# Altium schematic sheet Wheatstone bridge part III.SchDoc: Wheatstone bridge part III
size A4; Revision: 1; SheetNumber: 5; SheetTotal: 5; Units: mm
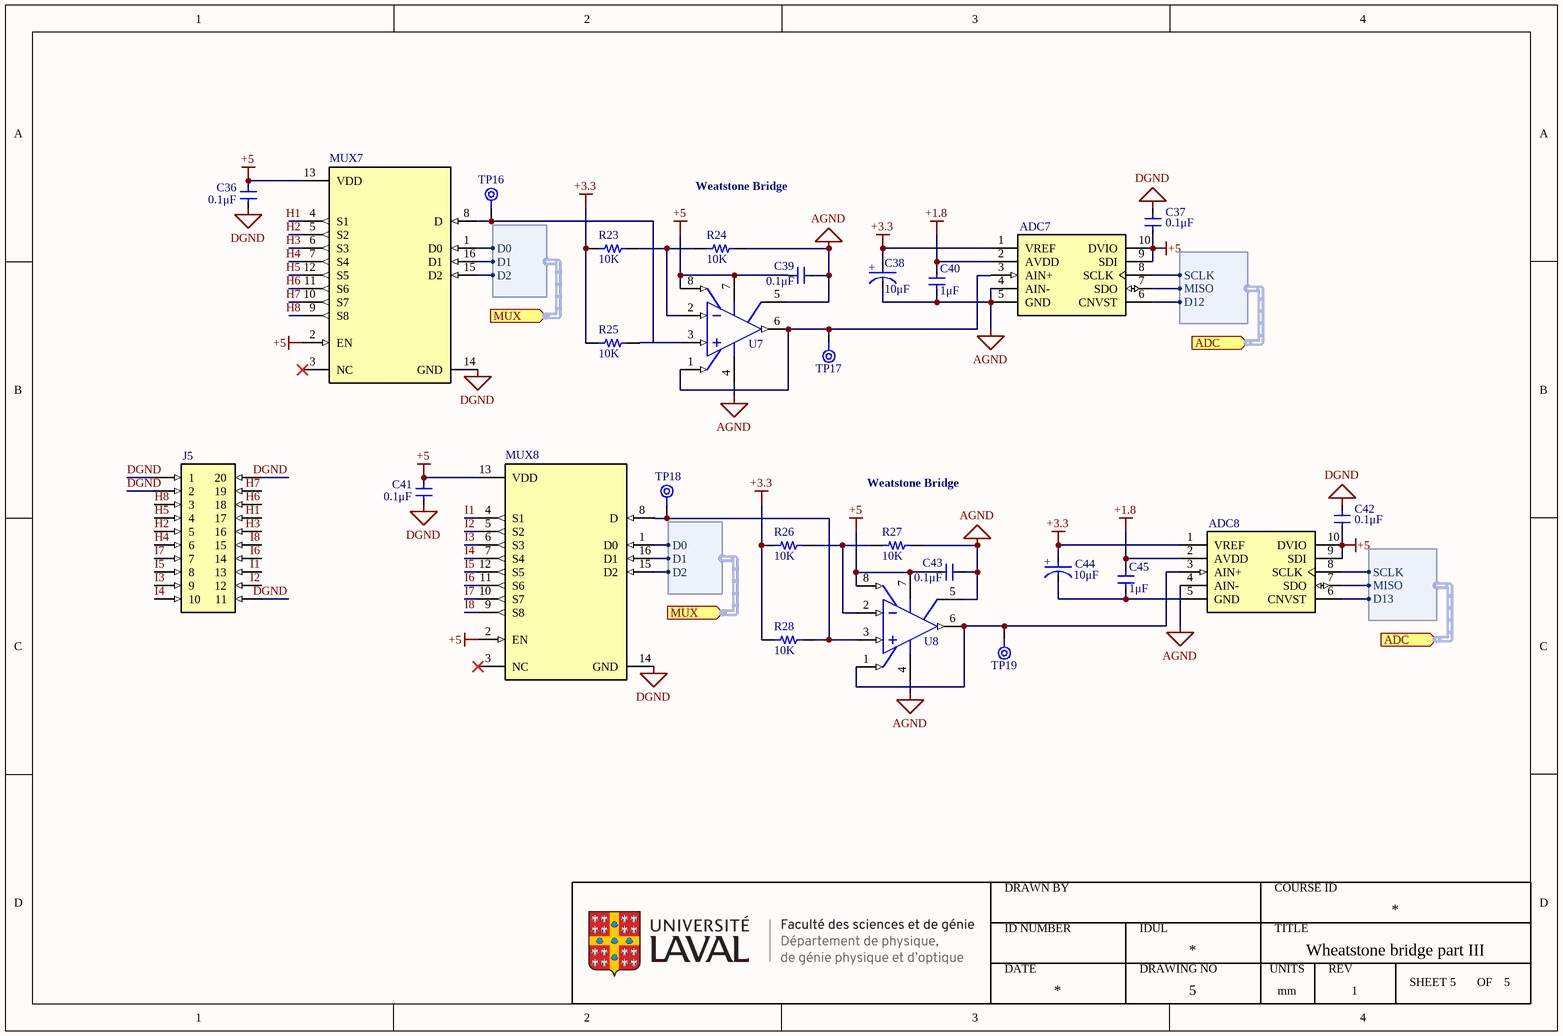
[diagram p0: Wheatstone bridge part III.SchDoc]

## Parts
ADC7  (no value)  [MCP33141-10-E/MS]
ADC8  (no value)  [MCP33141-10-E/MS]
C36  Capacitance: 0.1μF  [Cap Yaego 0603 MFG]  (hidden comment: Cap Ceramic 0.1 uF SMT 0603)
C37  Capacitance: 0.1μF  [Cap Ceramic 0.1 uF 50V SMT 0603]  (hidden comment: CC0603JRX7R9BB104)
C38  value 10μF  [Cap Tantalum 10 uF 16V SMT 1411]  (hidden comment: Cap 10 uF 16V Tantalum 1411)
C39  Capacitance: 0.1μF  [Cap Ceramic 0.1 uF 50V SMT 0603]  (hidden comment: Cap Ceramic 0.1 uF SMT 0603)
C40  value 1μF  [Cap Ceramic 1 uF 16V SMT 0603]  (hidden comment: Cap Ceramic 1 uF SMT 0603)
C41  Capacitance: 0.1μF  [Cap Yaego 0603 MFG]  (hidden comment: Cap Ceramic 0.1 uF SMT 0603)
C42  Capacitance: 0.1μF  [Cap Ceramic 0.1 uF 50V SMT 0603]  (hidden comment: CC0603JRX7R9BB104)
C43  Capacitance: 0.1μF  [Cap Ceramic 0.1 uF 50V SMT 0603]  (hidden comment: Cap Ceramic 0.1 uF SMT 0603)
C44  value 10μF  [Cap Tantalum 10 uF 16V SMT 1411]  (hidden comment: Cap 10 uF 16V Tantalum 1411)
C45  value 1μF  [Cap Ceramic 1 uF 16V SMT 0603]  (hidden comment: Cap Ceramic 1 uF SMT 0603)
J5  BF050-20-A-B-0400-0300-L-G  [Headers 20 Pos TH 0.079" 4-3 - B]  (value not drawn)
MUX7  TMUX1208PWR  [TMUX1208PWR]  (value not drawn)
MUX8  TMUX1208PWR  [TMUX1208PWR]  (value not drawn)
R23  value 10K  [Res 10K 0.1% SMT 0603]  (hidden comment: Res 10K SMT 0603)
R24  value 10K  [Res 10K 0.1% SMT 0603]  (hidden comment: Res 10K SMT 0603)
R25  value 10K  [Res 10K 0.1% SMT 0603]  (hidden comment: Res 10K SMT 0603)
R26  value 10K  [Res 10K 0.1% SMT 0603]  (hidden comment: Res 10K SMT 0603)
R27  value 10K  [Res 10K 0.1% SMT 0603]  (hidden comment: Res 10K SMT 0603)
R28  value 10K  [Res 10K 0.1% SMT 0603]  (hidden comment: Res 10K SMT 0603)
TP16  Test Point  [SQ Pad]  (value not drawn)  (no BOM)
TP17  Test Point  [SQ Pad]  (value not drawn)  (no BOM)
TP18  Test Point  [SQ Pad]  (value not drawn)  (no BOM)
TP19  Test Point  [SQ Pad]  (value not drawn)  (no BOM)
U7  Instrumentation Op Amp 35 MHz 8 pins  [MCP6N11-100E/SN]  (value not drawn)
U8  Instrumentation Op Amp 35 MHz 8 pins  [MCP6N11-100E/SN]  (value not drawn)

## Ports
ADC (in, harness 16), ADC (in, harness 18), MUX (in, harness 15), MUX (in, harness 17)

## Harnesses
15: D0, D1, D2
16: SCLK, MISO, D12
17: D0, D1, D2
18: SCLK, MISO, D13

## Nets
+1.8: ADC7.2(AVDD) ADC8.2(AVDD) C40.1 C45.1
+3.3: ADC7.1(VREF) ADC8.1(VREF) C38.2(A) C44.2(A) R23.1 R25.1 R26.1 R28.1
+5: ADC7.9(SDI) ADC7.10(DVIO) ADC8.9(SDI) ADC8.10(DVIO) C36.2 C37.1 C39.1 C41.2 C42.1 C43.1 MUX7.2(EN) MUX7.13(VDD) MUX8.2(EN) MUX8.13(VDD) U7.7(VDD) U7.8(EN/~{CAL}) U8.7(VDD) U8.8(EN/~{CAL})
AGND: ADC7.4(AIN-) ADC7.5(GND) ADC8.4(AIN-) ADC8.5(GND) C38.1(C) C39.2 C40.2 C43.2 C44.1(C) C45.2 R24.2 R27.2 U7.4(VSS) U7.5(VREF) U8.4(VSS) U8.5(VREF)
DGND: C36.1 C37.2 C41.1 C42.2 J5.1 J5.2 J5.11 J5.20 MUX7.14(GND) MUX8.14(GND)
H1: J5.17 MUX7.4(S1)
H2: J5.5 MUX7.5(S2)
H3: J5.16 MUX7.6(S3)
H4: J5.6 MUX7.7(S4)
H5: J5.4 MUX7.12(S5)
H6: J5.18 MUX7.11(S6)
H7: J5.19 MUX7.10(S7)
H8: J5.3 MUX7.9(S8)
I1: J5.13 MUX8.4(S1)
I2: J5.12 MUX8.5(S2)
I3: J5.9 MUX8.6(S3)
I4: J5.10 MUX8.7(S4)
I5: J5.8 MUX8.12(S5)
I6: J5.14 MUX8.11(S6)
I7: J5.7 MUX8.10(S7)
I8: J5.15 MUX8.9(S8)
NetADC7_3: ADC7.3(AIN+) TP17.1(TP) U7.1(VFG) U7.6(VOUT)
NetADC7_6: ADC7.6(CNVST) ; port ADC.D12
NetADC7_7: ADC7.7(SDO) ADC8.7(SDO) ; port ADC.MISO
NetADC7_8: ADC7.8(SCLK) ADC8.8(SCLK) ; port ADC.SCLK
NetADC8_3: ADC8.3(AIN+) TP19.1(TP) U8.1(VFG) U8.6(VOUT)
NetADC8_6: ADC8.6(CNVST) ; port ADC.D13
NetMUX7_1: MUX7.1(D0) MUX8.1(D0) ; port MUX.D0
NetMUX7_8: MUX7.8(D) R25.2 TP16.1(TP) U7.3(VIP)
NetMUX7_15: MUX7.15(D2) MUX8.15(D2) ; port MUX.D2
NetMUX7_16: MUX7.16(D1) MUX8.16(D1) ; port MUX.D1
NetMUX8_8: MUX8.8(D) R28.2 TP18.1(TP) U8.3(VIP)
NetR23_2: R23.2 R24.1 U7.2(VIM)
NetR26_2: R26.2 R27.1 U8.2(VIM)

Not connected (* = marked no-connect by the designer): MUX7 3(NC)*; MUX8 3(NC)*

## Notes on the sheet
- Weatstone Bridge
- DRAWN BY
- COURSE ID
- ID NUMBER
- DATE
- IDUL
- DRAWING NO
- TITLE
- UNITS
- REV
- SHEET
- OF
- (in symbol Cap 10 uF 16V Tantalum 1411) +

## Library data of the parts
ADC7 ADC8 = ADC 12 bits 1MSPS: 12 Bit Analog to Digital Converter 1 Input 1 SAR 10-MSOP; Supplier 1: Digi-Key; Supplier Part Number 1: MCP33141-10-E/MS-ND
C36 C39 C41 C43 = Cap Ceramic 0.1 uF SMT 0603: 0.1 µF ±5% 50V Ceramic Capacitor X7R 0603 (1608 Metric); Part Number: CC0603JRX7R9BB104; manufacturer: Yageo; Applications: General Purpose; componentlink1description: Datasheet; componentlink1url: https://www.yageo.com/upload/media/product/productsearch/datasheet/mlcc/UPY-GPHC_X7R_6.3V-to-50V_18.pdf; componentlink2description: DigiKey Link; componentlink2url: https://www.digikey.com/en/products/detail/yageo/CC0603JRX7R9BB104/5195188; Device Package: 0603 (1608 Metric); lastupdated: 2023-03-06 20:08:09; Lifecycle Status: Active; Minimum Order: 1; Mounting Type: Surface Mount, MLCC; Operating Temperature: -55°C ~ 125°C; Package / Case: 0603 (1608 Metric); packaging: TapeAndReel; partid: 12474; Part Status: Active; price: 0.01; series: CC; Size / Dimension: 0.063" L x 0.031" W (1.60mm x 0.80mm); Temperature Coefficient: X7R; Thickness (Max): 0.035" (0.90mm); Tolerance: ±5%; Voltage - Rated: 50V; Supplier 1: Digi-Key; Supplier Part Number 1: 311-1779-1-ND; Supplier 2: Digi-Key; Supplier Part Number 2: 311-1779-6-ND; Supplier 3: Digi-Key; Supplier Part Number 3: 311-1779-2-ND
C37 C42 = Cap Ceramic 0.1 uF SMT 0603: 0.1 µF ±5% 50V Ceramic Capacitor X7R 0603 (1608 Metric); manufacturer: Yageo; Part Number: CC0603JRX7R9BB104; Applications: General Purpose; componentlink1description: Datasheet; componentlink1url: https://www.yageo.com/upload/media/product/productsearch/datasheet/mlcc/UPY-GPHC_X7R_6.3V-to-50V_18.pdf; componentlink2description: DigiKey Link; componentlink2url: https://www.digikey.com/en/products/detail/yageo/CC0603JRX7R9BB104/5195188; Device Package: 0603 (1608 Metric); lastupdated: 2023-03-06 20:08:09; Lifecycle Status: Active; Minimum Order: 1; Mounting Type: Surface Mount, MLCC; Operating Temperature: -55°C ~ 125°C; Package / Case: 0603 (1608 Metric); packaging: TapeAndReel; partid: 12474; Part Status: Active; price: 0.01; series: CC; Size / Dimension: 0.063" L x 0.031" W (1.60mm x 0.80mm); Temperature Coefficient: X7R; Thickness (Max): 0.035" (0.90mm); Tolerance: ±5%; Voltage - Rated: 50V; Supplier 1: Digi-Key; Supplier Part Number 1: 311-1779-1-ND; Supplier 2: Digi-Key; Supplier Part Number 2: 311-1779-6-ND; Supplier 3: Digi-Key; Supplier Part Number 3: 311-1779-2-ND
C38 C44 = Cap 10 uF 16V Tantalum 1411: 10 µF Molded Tantalum Capacitors 16 V 1411 (3528 Metric) 2Ohm; Voltage Rating: 16V; Case Code (Imperial): 1411; Supplier 1: Digi-Key; Supplier Part Number 1: 718-1124-1-ND; Supplier 2: Digi-Key; Supplier Part Number 2: 718-1124-6-ND; Supplier 3: Digi-Key; Supplier Part Number 3: 718-1124-2-ND
C40 C45 = Cap Ceramic 1 uF SMT 0603: 1 µF ±10% 16V Ceramic Capacitor X7R 0603 (1608 Metric); Dielectric: XR7; Tolerance: 10%; Max Operating Temperature: 125°C; Case Code (Imperial): 0603; Voltage Rating (DC): 16V; Resistor Type: Ceramic; Height: 0.8mm; Length: 1.6mm; Construction: Flat; Termination: SMT/SMD; Min Operating Temperature: -55°C; Supplier 1: Digi-Key; Supplier Part Number 1: 13-CC0603KPX7R7BB105CT-ND; Supplier 2: Digi-Key; Supplier Part Number 2: 13-CC0603KPX7R7BB105DKR-ND; Supplier 3: Digi-Key; Supplier Part Number 3: 13-CC0603KPX7R7BB105TR-ND
J5 = Headers 20 Pos TH 0.079" 4-3: Connector Header Through Hole 20 position 0.079" (2.00mm); Supplier 1: Digi-Key; Supplier Part Number 1: 2073-BF050-20-A-B-0400-0300-L-G-ND
MUX7 MUX8 = MUX Analog 8:1: 5-V, 8: 1, 1-channel general-purpose analog multiplexer with 1.8-V input logic 16-TSSOP -40 to 125; Supplier 1: Digi-Key; Supplier Part Number 1: 296-51847-1-ND; Supplier 2: Digi-Key; Supplier Part Number 2: 296-51847-6-ND; Supplier 3: Digi-Key; Supplier Part Number 3: 296-51847-2-ND; ComponentLink1Description: Datasheet; ComponentLink1URL: https://www.ti.com/lit/ds/symlink/tmux1208.pdf?HQS=dis-dk-null-digikeymode-dsf-pf-null-wwe&ts=1678139087624&ref_url=https%253A%252F%252Fwww.ti.com%252Fgeneral%252Fdocs%252Fsuppproductinfo.tsp%253FdistId%253D10%2526gotoUrl%253Dhttps%253A%252F%252Fwww.ti.com%252Flit%252Fgpn%252Ftmux1208
R23-R28 = Res 10K SMT 0603: 10 kΩ  ±0.1% 0.1W, 1/10W Chip Resistor 0603 (1608 Metric) Thin Film; Part Number: RT0603BRD0710KL; Manufacturer: Yageo; Temperature Coefficient: ±25ppm/°C; ComponentLink1Description: Datasheet; ComponentLink1URL: https://www.yageo.com/upload/media/product/productsearch/datasheet/rchip/PYu-RT_1-to-0.01_RoHS_L_11.pdf; ComponentLink2Description: DigiKey Link; ComponentLink2URL: https://www.digikey.com/en/products/detail/yageo/RT0603BRD0710KL/1072198; Composition: Thin Film; Device Package: 0603 (1608 Metric); Height - Seated (Max): 0.022" (0.55mm); LastUpdated: 2023-03-06 20:27:57; Lifecycle Status: Active; Minimum Order: 1; Number of Terminations: 2; Operating Temperature: -55°C ~ 155°C; Package / Case: 0603 (1608 Metric); Packaging: TapeAndReel; PartId: 22611; Part Status: Active; Power (Watts): 0.1W, 1/10W; Price: 0.03; Resistance: 10K; Series: RT; Size / Dimension: 0.063" L x 0.031" W (1.60mm x 0.80mm); Supplier Device Package: 0603; Tolerance: ±0.1%; Supplier 1: Digi-Key; Supplier Part Number 1: YAG1236CT-ND; Supplier 2: Digi-Key; Supplier Part Number 2: YAG1236DKR-ND; Supplier 3: Digi-Key; Supplier Part Number 3: YAG1236TR-ND
U7 U8 = Instrumentation Op Amp 35 MHz 8 pins: Instrumentation Amplifier 1 Circuit Rail-to-Rail 8-SOIC; Supplier 1: Digi-Key; Supplier Part Number 1: MCP6N11-100E/SN-ND